# EAGLE schematic rtc (EAGLE 5.10)
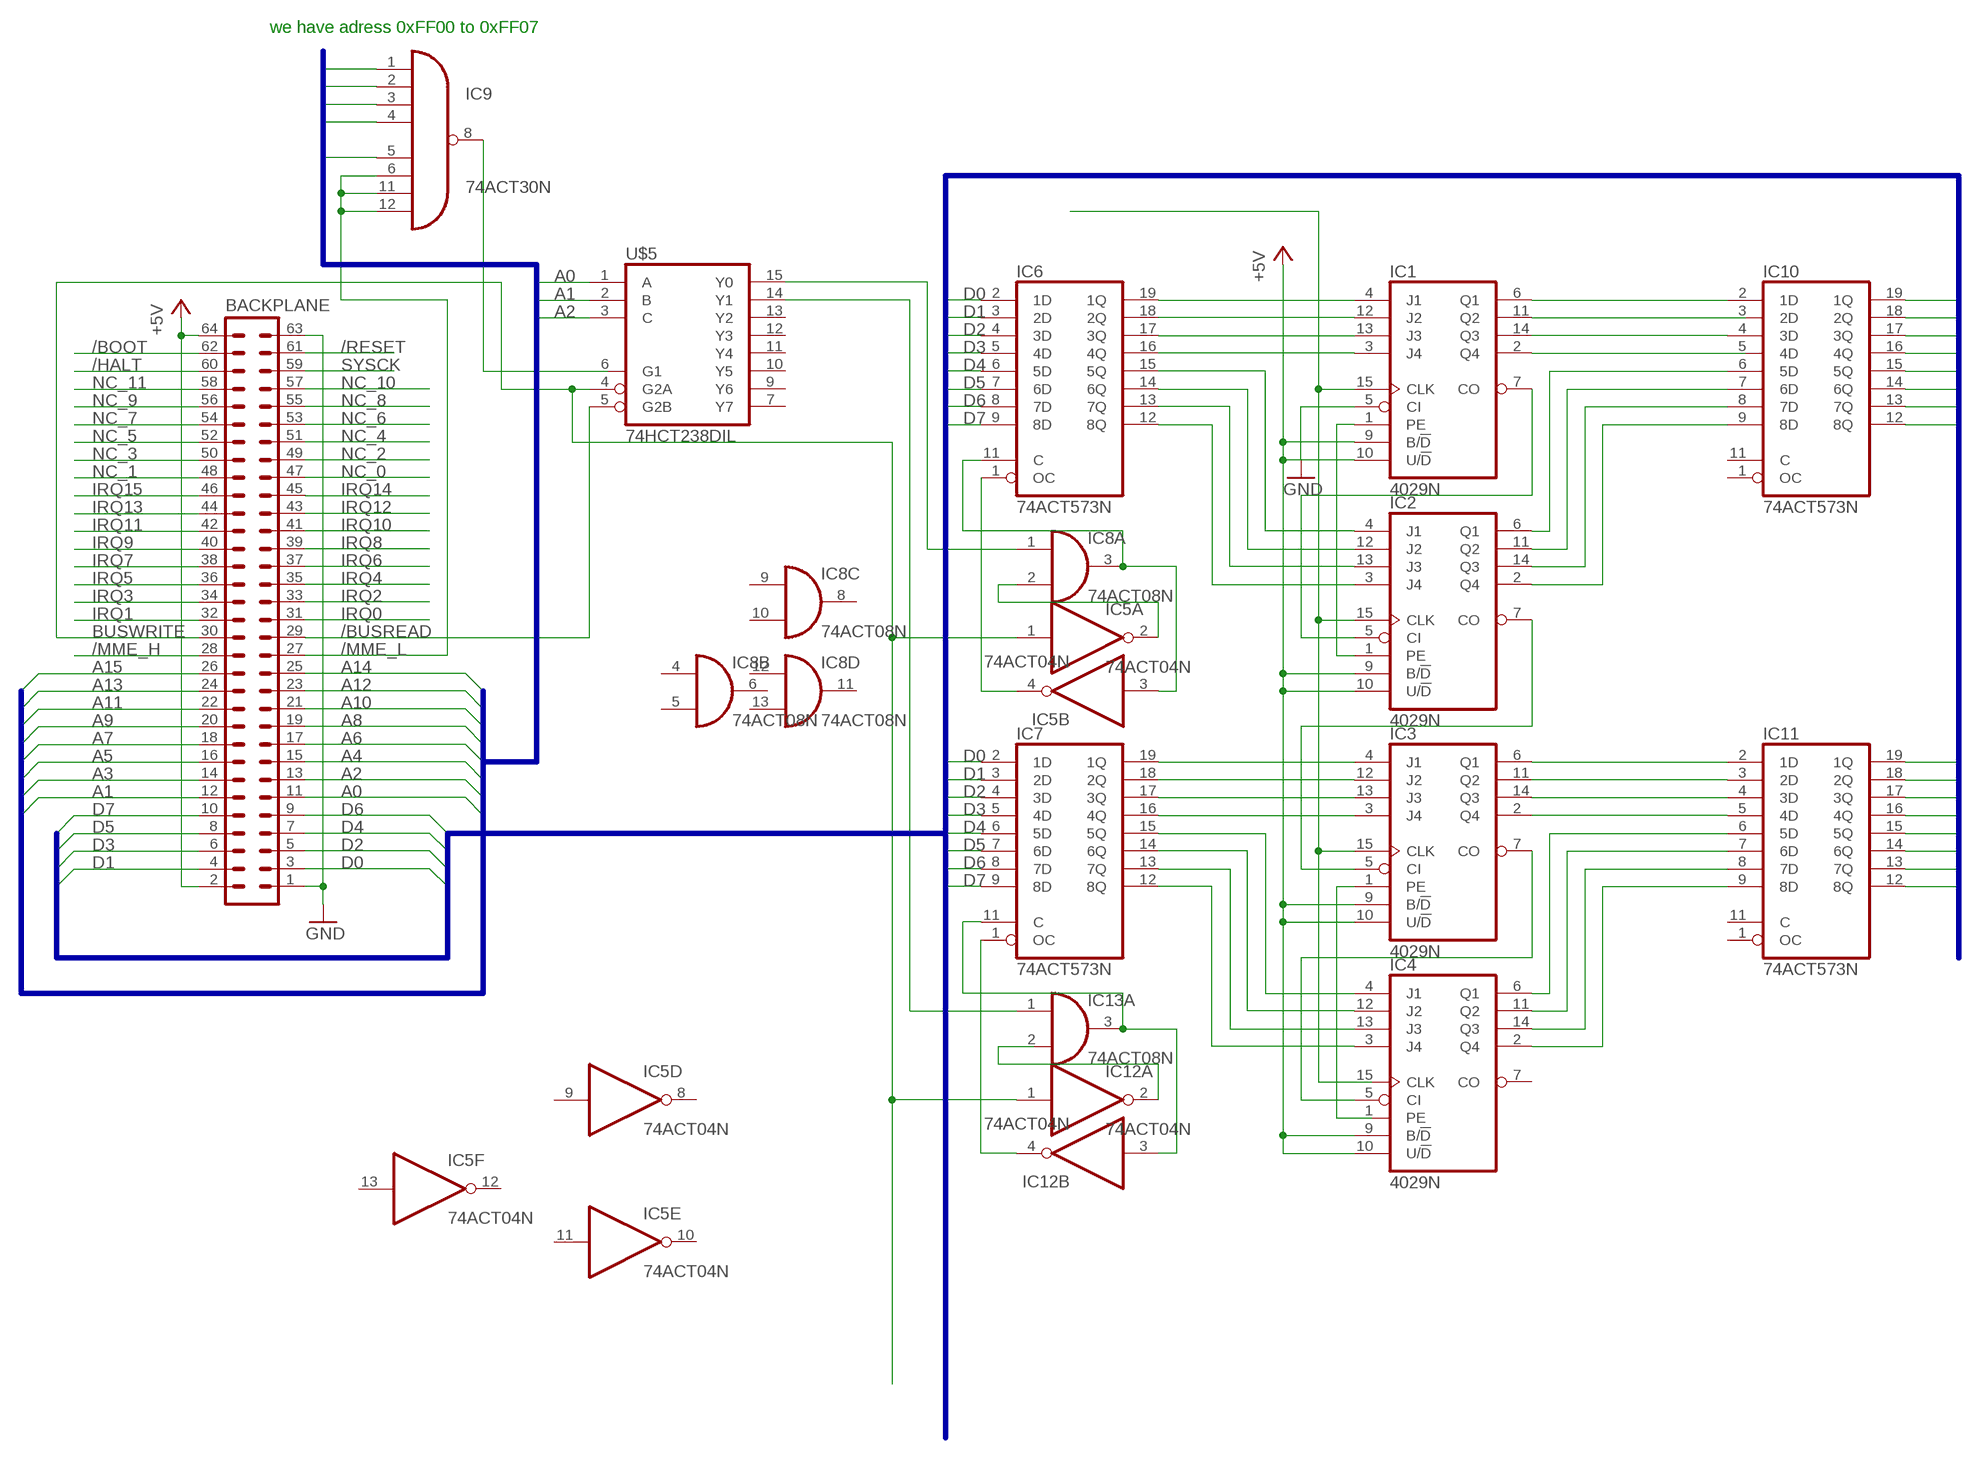
[diagram p0: schematic, sheet 1]

## Parts
BACKPLANE  ML64L  [ML64L]
IC1  4029N  [DIL16]
IC2  4029N  [DIL16]
IC3  4029N  [DIL16]
IC4  4029N  [DIL16]
IC5  74ACT04N  [DIL14]
IC6  74ACT573N  [DIL20]
IC7  74ACT573N  [DIL20]
IC8  74ACT08N  [DIL14]
IC9  74ACT30N  [DIL14]
IC10  74ACT573N  [DIL20]
IC11  74ACT573N  [DIL20]
IC12  74ACT04N  [DIL14]
IC13  74ACT08N  [DIL14]
U$5  74HCT238DIL  [DIL16]

## Nets
+5V: BACKPLANE.2 BACKPLANE.64 IC1.9(B/!D) IC1.10(U/!D) IC2.9(B/!D) IC2.10(U/!D) IC3.9(B/!D) IC3.10(U/!D) IC4.9(B/!D) IC4.10(U/!D)
/BOOT: BACKPLANE.62
/BUSREAD: BACKPLANE.29
/HALT: BACKPLANE.60
/MME_H: BACKPLANE.28
/MME_L: BACKPLANE.27 IC9.6(I5) IC9.11(I6) IC9.12(I7)
/RESET: BACKPLANE.61
A0: BACKPLANE.11 U$5.1(A)
A1: BACKPLANE.12 U$5.2(B)
A2: BACKPLANE.13 U$5.3(C)
A3: BACKPLANE.14 IC9.1(I0)
A4: BACKPLANE.15 IC9.2(I1)
A5: BACKPLANE.16 IC9.3(I2)
A6: BACKPLANE.17 IC9.4(I3)
A7: BACKPLANE.18 IC9.5(I4)
A8: BACKPLANE.19
A9: BACKPLANE.20
A10: BACKPLANE.21
A11: BACKPLANE.22
A12: BACKPLANE.23
A13: BACKPLANE.24
A14: BACKPLANE.25
A15: BACKPLANE.26
BUSWRITE: BACKPLANE.30 IC5.1(A:I) IC12.1(A:I) U$5.4(G2A)
D0: BACKPLANE.3 IC6.2(1D) IC7.2(1D) IC10.19(1Q) IC11.19(1Q)
D1: BACKPLANE.4 IC6.3(2D) IC7.3(2D) IC10.18(2Q) IC11.18(2Q)
D2: BACKPLANE.5 IC6.4(3D) IC7.4(3D) IC10.17(3Q) IC11.17(3Q)
D3: BACKPLANE.6 IC6.5(4D) IC7.5(4D) IC10.16(4Q) IC11.16(4Q)
D4: BACKPLANE.7 IC6.6(5D) IC7.6(5D) IC10.15(5Q) IC11.15(5Q)
D5: BACKPLANE.8 IC6.7(6D) IC7.7(6D) IC10.14(6Q) IC11.14(6Q)
D6: BACKPLANE.9 IC6.8(7D) IC7.8(7D) IC10.13(7Q) IC11.13(7Q)
D7: BACKPLANE.10 IC6.9(8D) IC7.9(8D) IC10.12(8Q) IC11.12(8Q)
GND: BACKPLANE.1 BACKPLANE.63 IC1.5(CI)
IRQ0: BACKPLANE.31
IRQ1: BACKPLANE.32
IRQ2: BACKPLANE.33
IRQ3: BACKPLANE.34
IRQ4: BACKPLANE.35
IRQ5: BACKPLANE.36
IRQ6: BACKPLANE.37
IRQ7: BACKPLANE.38
IRQ8: BACKPLANE.39
IRQ9: BACKPLANE.40
IRQ10: BACKPLANE.41
IRQ11: BACKPLANE.42
IRQ12: BACKPLANE.43
IRQ13: BACKPLANE.44
IRQ14: BACKPLANE.45
IRQ15: BACKPLANE.46
N$1: IC1.7(CO) IC2.5(CI)
N$2: IC2.7(CO) IC3.5(CI)
N$3: IC3.7(CO) IC4.5(CI)
N$4: U$5.5(G2B)
N$5: IC1.4(J1) IC6.19(1Q)
N$6: IC1.12(J2) IC6.18(2Q)
N$7: IC1.13(J3) IC6.17(3Q)
N$8: IC1.3(J4) IC6.16(4Q)
N$9: IC2.4(J1) IC6.15(5Q)
N$10: IC2.12(J2) IC6.14(6Q)
N$11: IC2.13(J3) IC6.13(7Q)
N$12: IC2.3(J4) IC6.12(8Q)
N$13: IC3.4(J1) IC7.19(1Q)
N$14: IC3.12(J2) IC7.18(2Q)
N$15: IC3.13(J3) IC7.17(3Q)
N$16: IC3.3(J4) IC7.16(4Q)
N$17: IC1.15(CLK) IC2.15(CLK) IC3.15(CLK)
N$18: IC1.1(PE) IC2.1(PE)
N$19: IC13.1(A:I0) U$5.14(Y1)
N$20: IC8.1(A:I0) U$5.15(Y0)
N$21: IC7.11(C) IC12.3(B:I) IC13.3(A:O)
N$22: IC4.4(J1) IC7.15(5Q)
N$23: IC4.12(J2) IC7.14(6Q)
N$24: IC4.13(J3) IC7.13(7Q)
N$25: IC4.3(J4) IC7.12(8Q)
N$26: IC3.1(PE)
N$27: IC9.8(O)
N$28: IC1.6(Q1) IC10.2(1D)
N$29: IC1.11(Q2)
N$30: IC1.14(Q3) IC10.4(3D)
N$31: IC1.2(Q4)
N$32: IC2.6(Q1) IC10.6(5D)
N$33: IC2.11(Q2) IC10.7(6D)
N$34: IC2.14(Q3) IC10.8(7D)
N$35: IC2.2(Q4) IC10.9(8D)
N$36: IC3.6(Q1) IC11.2(1D)
N$37: IC3.11(Q2) IC11.3(2D)
N$38: IC3.14(Q3) IC11.4(3D)
N$39: IC3.2(Q4) IC11.5(4D)
N$40: IC4.6(Q1) IC11.6(5D)
N$41: IC4.11(Q2) IC11.7(6D)
N$42: IC4.14(Q3) IC11.8(7D)
N$43: IC4.2(Q4) IC11.9(8D)
N$44: IC5.3(B:I) IC6.11(C) IC8.3(A:O)
N$45: IC5.2(A:O) IC8.2(A:I1)
N$46: IC5.4(B:O) IC6.1(OC)
N$47: IC12.2(A:O)
N$49: IC7.1(OC) IC12.4(B:O)
NC_0: BACKPLANE.47
NC_1: BACKPLANE.48
NC_2: BACKPLANE.49
NC_3: BACKPLANE.50
NC_4: BACKPLANE.51
NC_5: BACKPLANE.52
NC_6: BACKPLANE.53
NC_7: BACKPLANE.54
NC_8: BACKPLANE.55
NC_9: BACKPLANE.56
NC_10: BACKPLANE.57
NC_11: BACKPLANE.58
SYSCK: BACKPLANE.59
Unconnected: IC4.1(PE) IC4.7(CO) IC4.15(CLK) IC5.5(C:I) IC5.6(C:O) IC5.8(D:O) IC5.9(D:I) IC5.10(E:O) IC5.11(E:I) IC5.12(F:O) IC5.13(F:I) IC8.4(B:I0) IC8.5(B:I1) IC8.6(B:O) IC8.8(C:O) IC8.9(C:I0) IC8.10(C:I1) IC8.11(D:O) IC8.12(D:I0) IC8.13(D:I1) IC10.1(OC) IC10.3(2D) IC10.5(4D) IC10.11(C) IC11.1(OC) IC11.11(C) IC12.5(C:I) IC12.6(C:O) IC12.8(D:O) IC12.9(D:I) IC12.10(E:O) IC12.11(E:I) IC12.12(F:O) IC12.13(F:I) IC13.2(A:I1) IC13.4(B:I0) IC13.5(B:I1) IC13.6(B:O) IC13.8(C:O) IC13.9(C:I0) IC13.10(C:I1) IC13.11(D:O) IC13.12(D:I0) IC13.13(D:I1) U$5.6(G1) U$5.7(Y7) U$5.9(Y6) U$5.10(Y5) U$5.11(Y4) U$5.12(Y3) U$5.13(Y2)

## Buses
D[0..7]
A[0..15]

## Notes on the sheet
- we have adress 0xFF00 to 0xFF07

## Power pins joined to a net without a drawn wire
GND: IC5.7(P:GND) IC6.10(GND) IC7.10(GND) IC8.7(P:GND) IC9.7(GND) IC10.10(GND) IC11.10(GND) IC12.7(P:GND) IC13.7(P:GND) U$5.8(GND)
VCC: IC5.14(P:VCC) IC6.20(VCC) IC7.20(VCC) IC8.14(P:VCC) IC9.14(VCC) IC10.20(VCC) IC11.20(VCC) IC12.14(P:VCC) IC13.14(P:VCC) U$5.16(VCC)
VDD: IC1.16(VDD) IC2.16(VDD) IC3.16(VDD) IC4.16(VDD)
VSS: IC1.8(VSS) IC2.8(VSS) IC3.8(VSS) IC4.8(VSS)

## Library data of the parts
BACKPLANE = mcpu:ML64L: HARTING
IC1-IC4 = mcpu:4029: Binary/decimal up/down COUNTER
IC5 IC12 = 74xx-eu:74*04: Hex INVERTER
IC6 IC7 IC10 IC11 = 74xx-eu:74*573: 8-bit D latch BUS DRIVER
IC8 IC13 = 74xx-eu:74*08: Quad 2-input AND gate
IC9 = 74xx-eu:74*30: 8-input NAND gate
U$5 = mcpu:74*238: 3 TO 8 LINE DECODER (DEMULTIPLEXER)

## Net classes
0 Signal: width 0.305 mm, drill 0.508 mm, clearance 0.203 mm
1 LoVolt42: width 0.61 mm, drill 0.508 mm, clearance 0.813 mm to class 0, clearance 0.305 mm
2 MedVolt100: width 0.61 mm, drill 0.508 mm, clearance 1.626 mm to class 0, clearance 1.626 mm to class 1, clearance 0.813 mm
3 LineVolt350: width 0.813 mm, drill 0.508 mm, clearance 12.7 mm to class 0, clearance 12.7 mm to class 1, clearance 12.7 mm to class 2, clearance 2.54 mm